# Altium project PCB_Project.PrjPcb
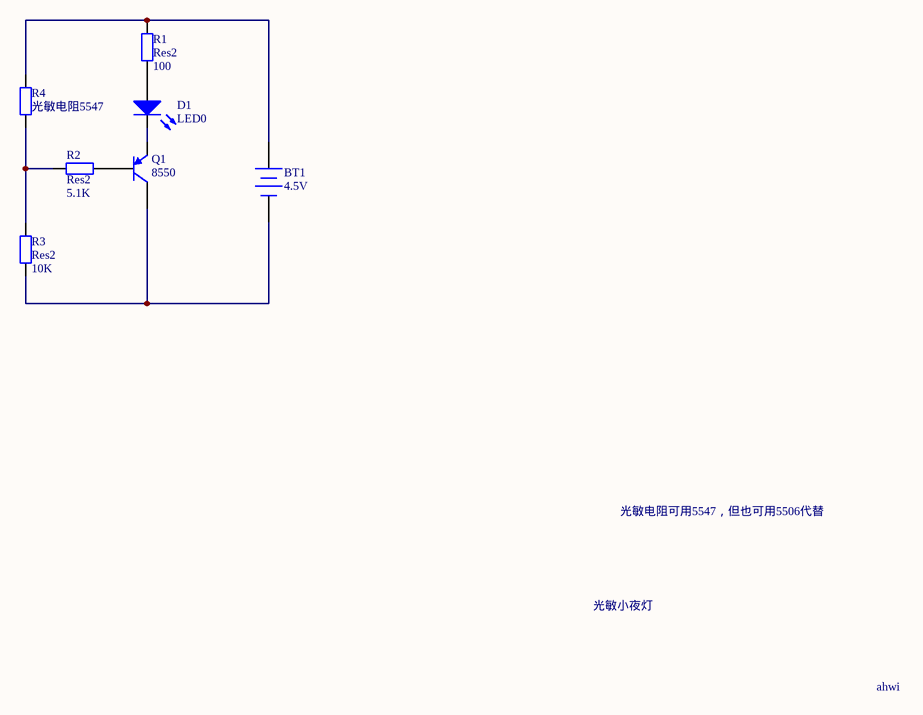
[diagram p0: Sheet1.SchDoc]
1 sheet, 7 parts. Net scope: global (net labels, ports and power ports of the same name join across sheets).

## Sheet Sheet1.SchDoc
size A4; SheetNumber: 1; SheetTotal: 1

### Parts
BT1  4.5V  [BAT-2]
D1  LED0  [LED-0]
Q1  8550  [SOT-23B_N]
R1  Res2  value 100  [AXIAL-0.4]
R2  Res2  value 5.1K  [AXIAL-0.4]
R3  Res2  value 10K  [AXIAL-0.4]
R4  光敏电阻5547  [AXIAL-0.4]

### Nets
NetBT1_1: BT1.1(+) R1.2 R4.2
NetBT1_2: BT1.2(-) Q1.1(C) R3.1
NetD1_1: D1.1(A) R1.1
NetD1_2: D1.2(K) Q1.3(E)
NetQ1_2: Q1.2(B) R2.2
NetR2_1: R2.1 R3.2 R4.1

### Notes on the sheet
- 光敏电阻可用5547，但也可用5506代替
- 光敏小夜灯
- ahwi

### Library data of the parts
BT1 = Battery: Multicell Battery; Published: 24-Mar-1999; LatestRevisionDate: 17-Jul-2002; LatestRevisionNote: Re-released for DXP Platform.; PackageReference: BAT-2; Publisher: Altium Limited; PackageDescription: Battery; 2 Leads
D1 = LED0: Typical INFRARED GaAs LED; Published: 8-Jun-2000; LatestRevisionDate: 08-Jul-2005; LatestRevisionNote: Mech Layer 1 removed.; PackageReference: LED-0; Publisher: Altium Limited; PackageDescription: LED; 2 Leads
Q1 = PNP: PNP Bipolar Transistor; Published: 8-Jun-2000; LatestRevisionDate: 29-May-2009; LatestRevisionNote: IPC-7351 Footprint Added.; PackageVersion: Aug-1999; PackageReference: SOT-23B; Publisher: Altium Limited; PackageDescription: 3-Pin SOT-23 Package 0.95 mm Pitch, 2.4 mm Lead Span
R1-R4 = Res2: Resistor; Published: 8-Jun-2000; LatestRevisionDate: 17-Jul-2002; LatestRevisionNote: Re-released for DXP Platform.; PackageReference: AXIAL-0.4; Publisher: Altium Limited; PackageDescription: Axial Device, Thru-Hole; 2 Leads; 0.4 in Pin Spacing